# EasyEDA Pro project S1.eprj

# Schematic Schematic1
Board Name: Board1; Create Date: 2025-07-27; Page Name: P1; Project Name: S1; Schematic Name: Schematic1; Update Date: 2025-07-29; Company: EasyEDA.com; Page Size: A4; Version: V1.0
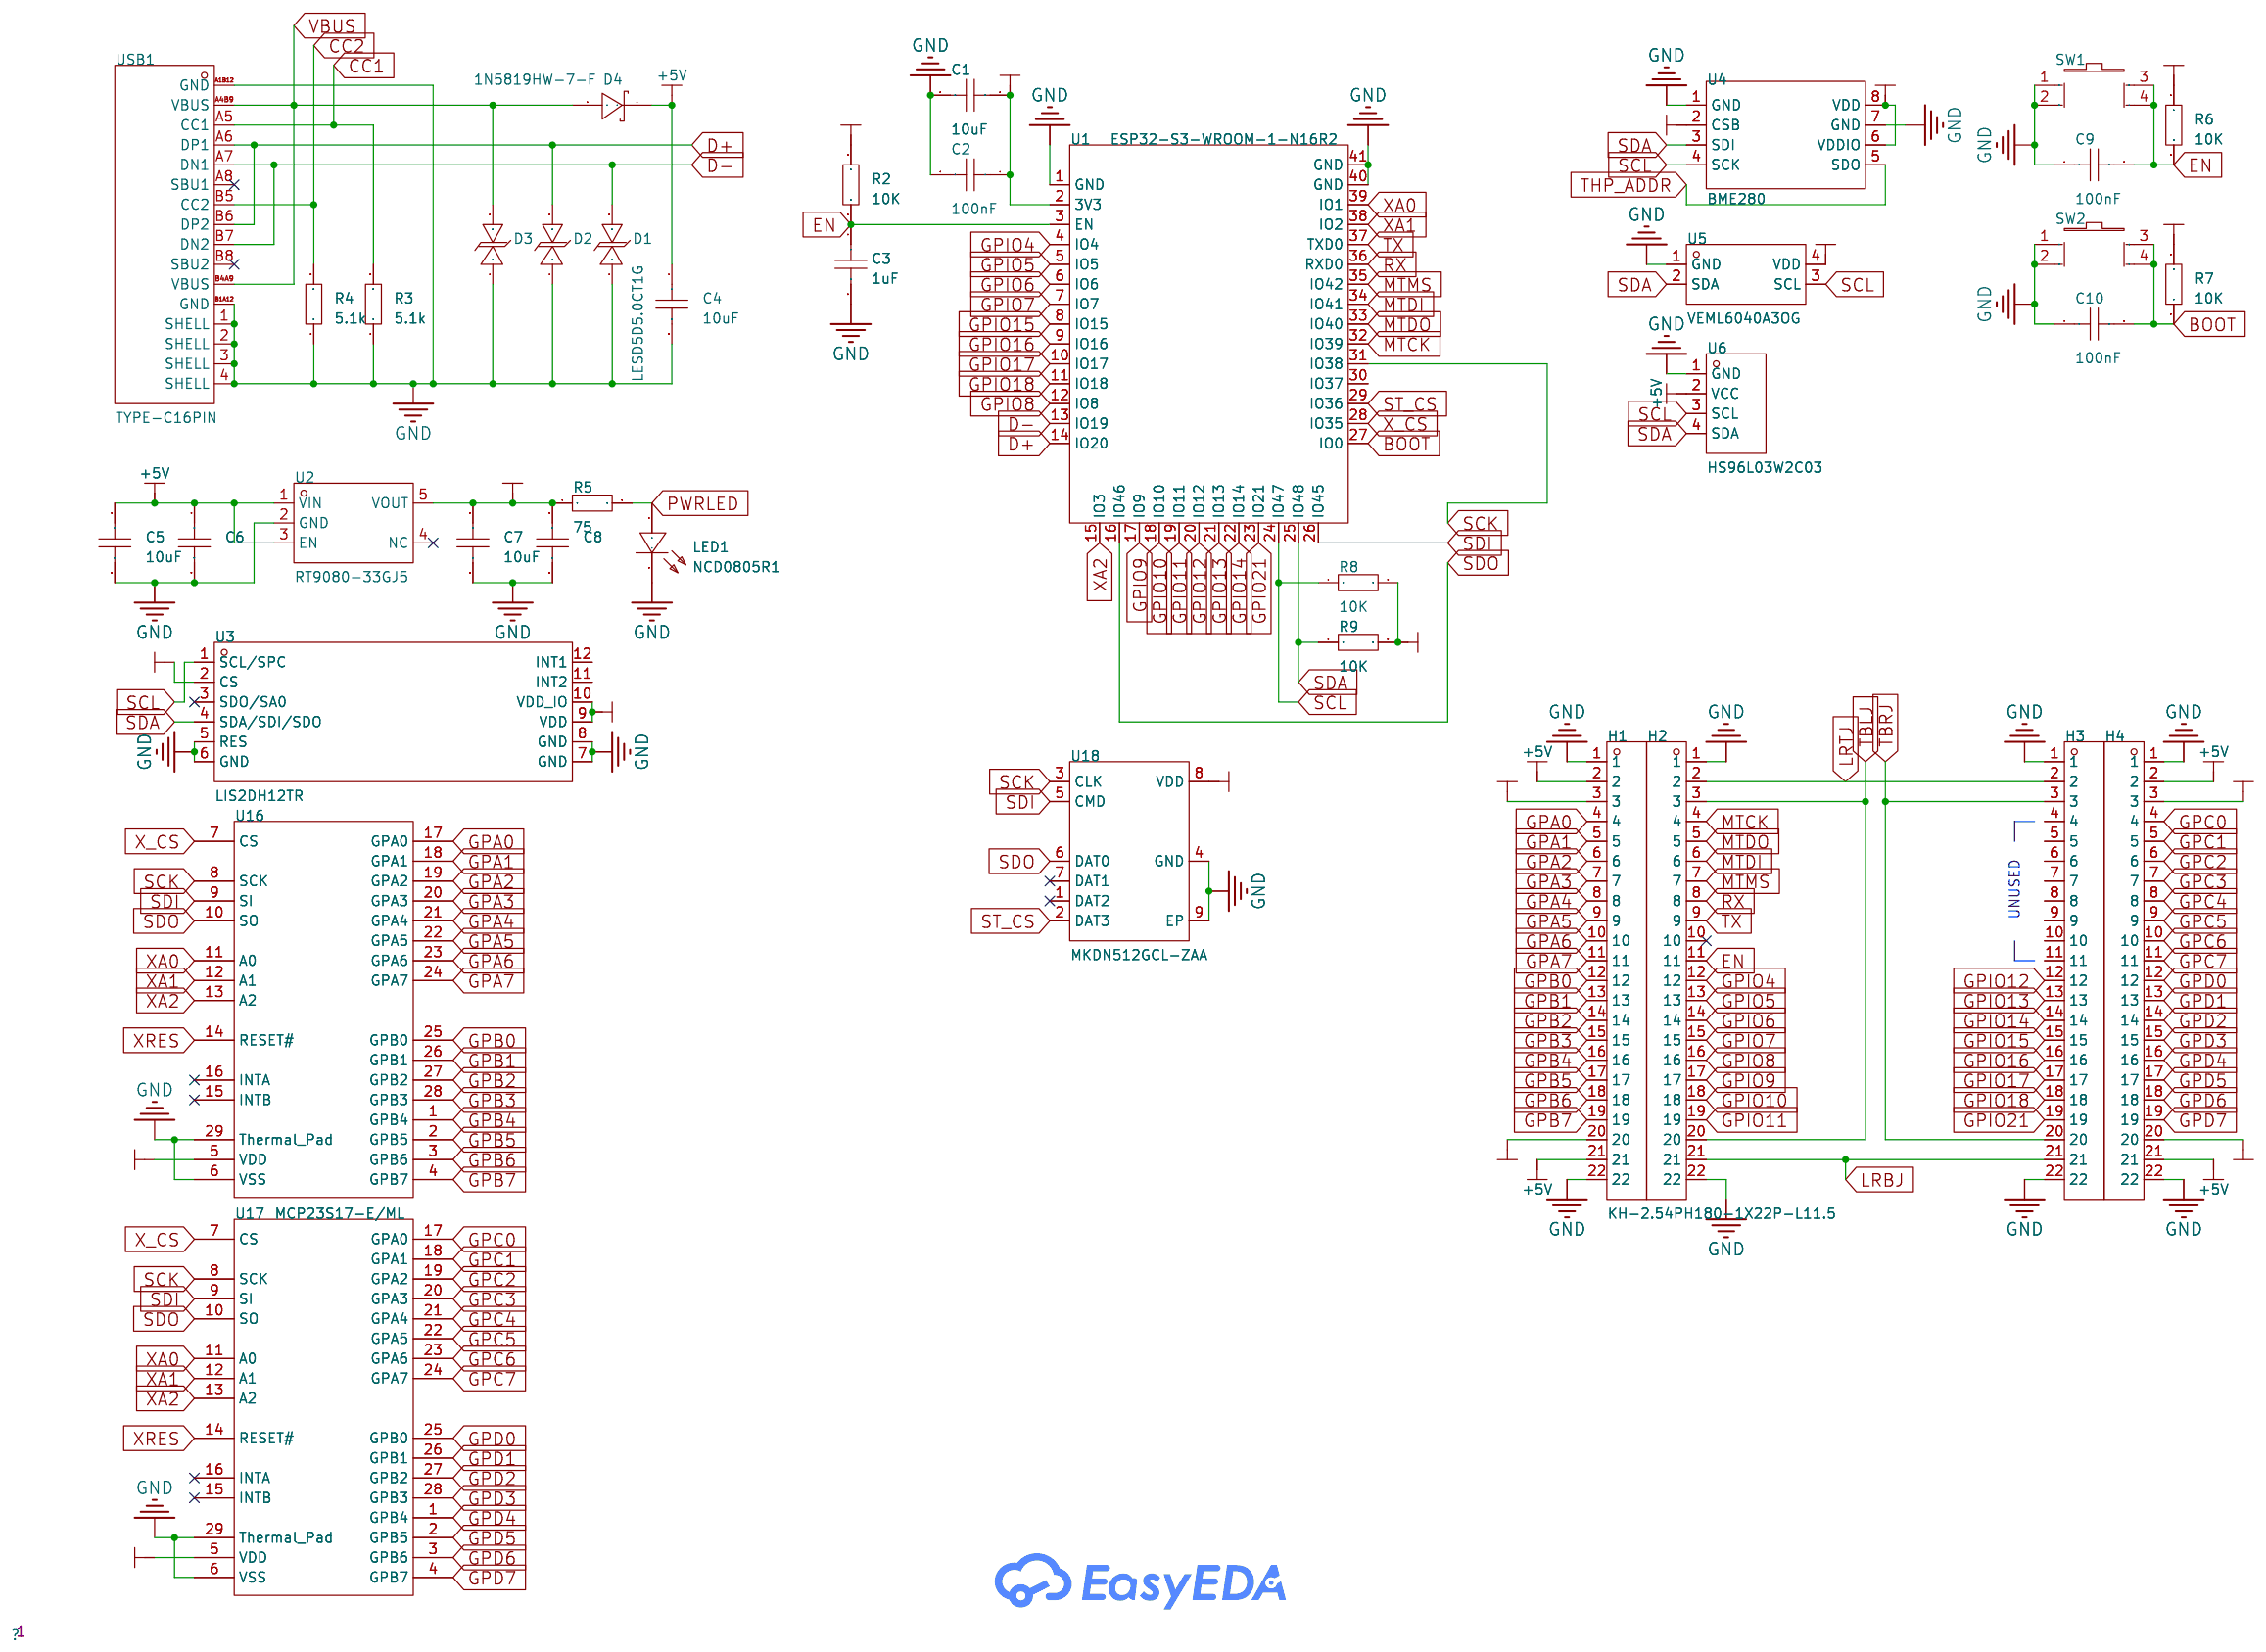
[diagram p0: schematic sheet]

## Parts
C1  10uF  [C0603]
C2  100nF  [C0603]
C3  1uF  [C0603]
C4  10uF  [C0603]
C5  10uF  [C0603]
C6  100nF  [C0603]
C7  10uF  [C0603]
C8  100nF  [C0603]
C9  100nF  [C0603]
C10  100nF  [C0603]
D1  LESD5D5.0CT1G  [SOD-523_L1.2-W0.8-LS1.6-BI]
D2  LESD5D5.0CT1G  [SOD-523_L1.2-W0.8-LS1.6-BI]
D3  LESD5D5.0CT1G  [SOD-523_L1.2-W0.8-LS1.6-BI]
D4  1N5819HW-7-F  [SOD-123_L2.7-W1.6-LS3.7-RD]
H1  KH-2.54PH180-1X22P-L11.5  [HDR-TH_22P-P2.54-V-M]
H2  KH-2.54PH180-1X22P-L11.5  [HDR-TH_22P-P2.54-V-M]
H3  KH-2.54PH180-1X22P-L11.5  [HDR-TH_22P-P2.54-V-M]
H4  KH-2.54PH180-1X22P-L11.5  [HDR-TH_22P-P2.54-V-M]
LED1  NCD0805R1  [LED0805-R-RD]
R2  10K  [R0603]
R3  5.1k  [R0603]
R4  5.1k  [R0603]
R5  75  [R0603]
R6  10K  [R0603]
R7  10K  [R0603]
R8  10K  [R0603]
R9  10K  [R0603]
SW1  PTS810SJG250SMTRLFS  [SW-SMD_4P_PTS810SJM250SMTRLFS]
SW2  PTS810SJG250SMTRLFS  [SW-SMD_4P_PTS810SJM250SMTRLFS]
U1  ESP32-S3-WROOM-1-N16R2  [WIRELM-SMD_ESP32-S3-WROOM-1]
U2  RT9080-33GJ5  [TSOT-23-5_L2.9-W1.6-P0.95-LS2.8-BL]
U3  LIS2DH12TR  [LGA-12_L2.0-W2.0-P0.50-BL]
U4  BME280  [LGA-8_BME280_BL]
U5  VEML6040A3OG  [SENSOR_SMD_VEML6040A3OG]
U6  HS96L03W2C03  [OLED-TH_L27.8-W27.2-P2.54_C9900033791]
U16  MCP23S17-E/ML  [QFN-28_L6.0-W6.0-P0.65-BL-EP]
U17  MCP23S17-E/ML  [QFN-28_L6.0-W6.0-P0.65-BL-EP]
U18  MKDN512GCL-ZAA  [LGA-16_L12.5-W9.0-P1.27-TL-EP]
USB1  TYPE-C16PIN  [USB-C-SMD_TYPE-C16PIN]

## Library data of the parts
C1-C10 = CAP_0603: Supplier Footprint: 0603
D1-D3 = LESD5D5.0CT1G_C5199850: Supplier Part: C5199850; Manufacturer: UMW(友台半导体); Supplier Footprint: SOD-523; JLCPCB Part Class: Extended Part; Datasheet: https://atta.szlcsc.com/upload/public/pdf/source/20231109/3A3F4A5EA6FBA8B622F70BA286F4E0C0.pdf; Supplier: LCSC
D4 = 1N5819HW-7-F: LCSC Part Name: 电压:40V 电流:1A; Supplier Part: C82544; Manufacturer: DIODES(美台); Supplier Footprint: SOD-123; JLCPCB Part Class: Extended Part; Datasheet: https://atta.szlcsc.com/upload/public/pdf/source/20161024/1477288459223.pdf; Supplier: LCSC; Forward Voltage (Vf@If): 450mV@1A; Reverse Voltage (Vr): 40V; Rectified Current: 1A; Reverse Leakage Current (Ir): 1mA@40V
H1-H4 = KH-2.54PH180-1X22P-L11.5: LCSC Part Name: 1x22P 间距:2.54mm; Supplier Part: C20610289; Manufacturer: kinghelm(金航标); Supplier Footprint: 插件,P=2.54mm; JLCPCB Part Class: Extended Part; Datasheet: https://atta.szlcsc.com/upload/public/pdf/source/20240117/4D3622A7E89961A992C721F36FCFC9FD.pdf; Supplier: LCSC; Pin Structure: 1x22P; Pitch: 2.54mm; Number of Rows: Single Row
LED1 = NCD0805R1_C84256: Supplier Part: C84256; Manufacturer: 国星光电; Supplier Footprint: 0805; JLCPCB Part Class: Basic Part; Datasheet: https://atta.szlcsc.com/upload/public/pdf/source/20200820/C84256_F0A75A43B3EAD75808600A0514C76B99.pdf; Supplier: LCSC; Emitted Color: Red; Forward Voltage (VF): 1.6V~2.6V; Power Dissipation: 65mW; Forward Current: 20mA; Dominant Wavelength: 615nm~630nm; Diode Configuration: 独立二极管; Lens Color: 无色透明透镜; Luminous Intensity: 67mcd~195mcd; Viewing Angle: 130°; Operating Temperature: -30℃~+85℃
R2-R9 = Res_0603: Supplier Footprint: 0603
SW1 SW2 = PTS810SJG250SMTRLFS: LCSC Part Name: 轻触开关4.2mm*3.2mm，400gf; Supplier Part: C221895; Manufacturer: C&K; Supplier Footprint: SMD-4P,3.2x4.2mm; JLCPCB Part Class: Extended Part; Datasheet: https://atta.szlcsc.com/upload/public/pdf/source/20180613/C221897_9316320DEFA4333FA0E6C5D565B0D5EA.pdf; Supplier: LCSC; Circuit: SPST; Actuator Style: Round Button; Operating Force: 400gf; Mounting Style: Standing paste; Switch Length: 4.2mm; Switch Width: 3.2mm; Switch Height: 2.5mm; Contact Current: 50mA; Voltage Rating (DC): 16V; Pin Style: J-pin; Operating Temperature: -40℃~+85℃
U1 = ESP32-S3-WROOM-1-N16R2: LCSC Part Name: 通用型Wi-Fi+低功耗蓝牙MCU模组; Supplier Part: C2913205; Manufacturer: ESPRESSIF(乐鑫); Supplier Footprint: SMD,18x25.5mm; JLCPCB Part Class: Extended Part; Datasheet: https://atta.szlcsc.com/upload/public/pdf/source/20220628/A2AC12B3C87735CAEB7EBE2DBE80936C.pdf; Supplier: LCSC
U2 = RT9080-33GJ5: +3V3; Supplier Part: C841192; Manufacturer: RICHTEK(立锜); Supplier Footprint: TSOT-23-5; JLCPCB Part Class: Extended Part; Datasheet: SDA; Supplier: LCSC; Output Type: Fixed; Maximum Input Voltage: 5.5V; Output Voltage: +3V3; Output Current: 600mA; Power Supply Rejection Ratio (PSRR): 75dB@(1kHz); Dropout Voltage: 530mV@(600mA); standby current: 4uA; Feature: ESD Protection；Thermal Protection(TSD)；Overcurrent Protection(OCP)；With ability; Operating Temperature: -40℃~+85℃@(Ta); Output Polarity: Positive electrode; Number of Outputs: 1
U3 = LIS2DH12TR: Supplier Part: C110926; Manufacturer: ST(意法半导体); Supplier Footprint: LGA-12(2x2); JLCPCB Part Class: Extended Part; Datasheet: https://atta.szlcsc.com/upload/public/pdf/source/20171014/C110926_15079752606891037920.pdf; Supplier: LCSC; Axial Direction: X,Y,Z; Supply Voltage: 1.71V~3.6V; Operating Temperature: -40℃~+85℃
U4 = BME280: LCSC Part Name: 湿度：0%RH~100%RH; Supplier Part: C92489; Manufacturer: Bosch(博世); Supplier Footprint: LGA-8(2.5x2.5); JLCPCB Part Class: Extended Part; Datasheet: https://atta.szlcsc.com/upload/public/pdf/source/20230217/9358ECB1DA7C52D8F39392648E599102.pdf; Supplier: LCSC; Voltage - Supply: 1.71V~3.6V
U5 = VEML6040A3OG: Supplier Part: C78465; Manufacturer: VISHAY(威世); Supplier Footprint: OPLGA-4(1.3x2); JLCPCB Part Class: Extended Part; Datasheet: https://atta.szlcsc.com/upload/public/pdf/source/20180511/C78465_1ECCD5CBB0DFD90660DF8047804D95FA.pdf; Supplier: LCSC; Detection color: Red,Green,Blue,White; Interface Type: I2C; Supply Voltage: 2.5V~3.6V; Operating Temperature: -40℃~+85℃
U6 = HS96L03W2C03: LCSC Part Name: 0.96寸OLED显示屏窄白光IIC; Supplier Part: C5248080; Manufacturer: HS(汉昇); JLCPCB Part Class: Extended Part; Datasheet: https://atta.szlcsc.com/upload/public/pdf/source/20230627/763D01F79A90007632F098068C7C8AD9.pdf; Supplier: LCSC; Main Control Chip: SSD1315; Interface Type: I2C; Size: 0.96; Pixel Resolution: 128x64; Operating Temperature: -40℃~+70℃
U16 U17 = MCP23S17-E/ML: Supplier Part: C147896; Manufacturer: MICROCHIP(美国微芯); Supplier Footprint: QFN-28-EP(6x6); JLCPCB Part Class: Extended Part; Datasheet: https://atta.szlcsc.com/upload/public/pdf/source/20171120/C148096_15111748815831131858.pdf; Supplier: LCSC; Interface: SPI; Number of I/O: 16; Interrupt Output: With Interrupt Output; Voltage - Supply: 1.8V~5.5V; Clock Frequency: 10MHz; Operating Temperature: -40℃~+125℃
U18 = MKDN512GCL-ZAA: LCSC Part Name: 512Gb SD NAND 商业级SDNAND; Supplier Part: C17700147; Manufacturer: MK(米客方德); Supplier Footprint: LGA-16(9x12.5); JLCPCB Part Class: Extended Part; Datasheet: https://atta.szlcsc.com/upload/public/pdf/source/20230912/61DE496B9367E626E96A5C5416BBF249.pdf; Supplier: LCSC; Memory Size: 512Gbit; Clock Frequency: 208MHz; Voltage - Supply: 2.7V~3.6V; Operating Temperature: -25℃~+85℃; Interface: SD3.0
USB1 = TYPE-C16PIN: LCSC Part Name: Type-C 母 卧贴; Supplier Part: C393939; Manufacturer: SHOU HAN(首韩); Supplier Footprint: SMD; JLCPCB Part Class: Extended Part; Datasheet: https://atta.szlcsc.com/upload/public/pdf/source/20250618/9FBF2A26CFCE0E69298FA0B726710E9E.pdf; Supplier: LCSC; Connector Type: Type-C; Protocol Standard: USB 3.1; Gender: Female; Mounting Type: Surface Mount, Right Angle; Number of Contacts: 16P; Number of Ports: 1; Current Rating-Power: 3A; Voltage Rating: 30V; Connect-Disconnect Life: 10,000 Cycles; Detection color: Black; Operating Temperature: -40℃~+85℃

## Nets
+3V3: C1.1 C2.1 C7.1 C8.1 H1.3 H1.20 H4.3 H4.20 R2.2 R5.1 R6.1 R7.2 R8.2 R9.2 U1.2(3V3) U2.5(VOUT) U3.2(CS) U3.9(VDD) U3.10(VDD_IO) U4.2(CSB) U4.6(VDDIO) U4.8(VDD) U5.4(VDD) U16.5(VDD) U17.5(VDD) U18.8(VDD)
+5V: C4.1 C5.1 C6.1 D4.1(K) H1.2 H1.21 H4.2 H4.21 U2.1(VIN) U2.3(EN) U6.2(VCC)
GND: C1.2 C2.2 C3.2 C4.2 C5.2 C6.2 C7.2 C8.2 C9.1 C10.1 D1.1 D2.1 D3.1 H1.1 H1.22 H2.1 H2.22 H3.1 H3.22 H4.1 H4.22 LED1.2(-) R3.1 R4.1 SW1.1 SW1.2 SW2.1 SW2.2 U1.1(GND) U1.40(GND) U1.41(GND) U2.2(GND) U3.5(RES) U3.6(GND) U3.7(GND) U3.8(GND) U4.1(GND) U4.7(GND) U5.1(GND) U6.1(GND) U16.6(VSS) U16.29(Thermal Pad) U17.6(VSS) U17.29(Thermal Pad) U18.4(GND) U18.9(EP) USB1.1(SHELL) USB1.2(SHELL) USB1.3(SHELL) USB1.4(SHELL) USB1.A1B12(GND) USB1.B1A12(GND)
VBUS: D3.2 D4.2(A) USB1.A4B9(VBUS) USB1.B4A9(VBUS)
BOOT: C10.2 R7.1 SW2.3 SW2.4 U1.27(IO0)
CC1: R3.2 USB1.A5(CC1)
CC2: R4.2 USB1.B5(CC2)
D+: D2.2 U1.14(IO20) USB1.A6(DP1) USB1.B6(DP2)
D-: D1.2 U1.13(IO19) USB1.A7(DN1) USB1.B7(DN2)
EN: C3.1 C9.2 H2.11 R2.1 R6.2 SW1.3 SW1.4 U1.3(EN)
GPA0: H1.4 U16.17(GPA0)
GPA1: H1.5 U16.18(GPA1)
GPA2: H1.6 U16.19(GPA2)
GPA3: H1.7 U16.20(GPA3)
GPA4: H1.8 U16.21(GPA4)
GPA5: H1.9 U16.22(GPA5)
GPA6: H1.10 U16.23(GPA6)
GPA7: H1.11 U16.24(GPA7)
GPB0: H1.12 U16.25(GPB0)
GPB1: H1.13 U16.26(GPB1)
GPB2: H1.14 U16.27(GPB2)
GPB3: H1.15 U16.28(GPB3)
GPB4: H1.16 U16.1(GPB4)
GPB5: H1.17 U16.2(GPB5)
GPB6: H1.18 U16.3(GPB6)
GPB7: H1.19 U16.4(GPB7)
GPC0: H4.4 U17.17(GPA0)
GPC1: H4.5 U17.18(GPA1)
GPC2: H4.6 U17.19(GPA2)
GPC3: H4.7 U17.20(GPA3)
GPC4: H4.8 U17.21(GPA4)
GPC5: H4.9 U17.22(GPA5)
GPC6: H4.10 U17.23(GPA6)
GPC7: H4.11 U17.24(GPA7)
GPD0: H4.12 U17.25(GPB0)
GPD1: H4.13 U17.26(GPB1)
GPD2: H4.14 U17.27(GPB2)
GPD3: H4.15 U17.28(GPB3)
GPD4: H4.16 U17.1(GPB4)
GPD5: H4.17 U17.2(GPB5)
GPD6: H4.18 U17.3(GPB6)
GPD7: H4.19 U17.4(GPB7)
GPIO4: H2.12 U1.4(IO4)
GPIO5: H2.13 U1.5(IO5)
GPIO6: H2.14 U1.6(IO6)
GPIO7: H2.15 U1.7(IO7)
GPIO8: H2.16 U1.12(IO8)
GPIO9: H2.17 U1.17(IO9)
GPIO10: H2.18 U1.18(IO10)
GPIO11: H2.19 U1.19(IO11)
GPIO12: H3.12 U1.20(IO12)
GPIO13: H3.13 U1.21(IO13)
GPIO14: H3.14 U1.22(IO14)
GPIO15: H3.15 U1.8(IO15)
GPIO16: H3.16 U1.9(IO16)
GPIO17: H3.17 U1.10(IO17)
GPIO18: H3.18 U1.11(IO18)
GPIO21: H3.19 U1.23(IO21)
LRBJ: H2.21 H3.21
LRTJ: H2.2 H3.2
MTCK: H2.4 U1.32(IO39)
MTDI: H2.6 U1.34(IO41)
MTDO: H2.5 U1.33(IO40)
MTMS: H2.7 U1.35(IO42)
PWRLED: LED1.1(+) R5.2
RX: H2.8 U1.36(RXD0)
SCK: U1.31(IO38) U16.8(SCK) U17.8(SCK) U18.3(CLK)
SCL: R8.1 U1.24(IO47) U3.1(SCL/SPC) U4.4(SCK) U5.3(SCL) U6.3(SCL)
SDA: R9.1 U1.25(IO48) U3.4(SDA/SDI/SDO) U4.3(SDI) U5.2(SDA) U6.4(SDA)
SDI: U1.26(IO45) U16.9(SI) U17.9(SI) U18.5(CMD)
SDO: U1.16(IO46) U16.10(SO) U17.10(SO) U18.6(DAT0)
ST_CS: U1.29(IO36) U18.2(DAT3)
TBLJ: H2.3 H2.20
TBRJ: H3.3 H3.20
THP_ADDR: U4.5(SDO)
TX: H2.9 U1.37(TXD0)
X_CS: U1.28(IO35) U16.7(CS) U17.7(CS)
XA0: U1.39(IO1) U16.11(A0) U17.11(A0)
XA1: U1.38(IO2) U16.12(A1) U17.12(A1)
XA2: U1.15(IO3) U16.13(A2) U17.13(A2)
XRES: U16.14(RESET#) U17.14(RESET#)

Not connected (* = marked no-connect by the designer): H2 10*; H3 4 5 6 7 8 9 10 11; U1 30(IO37); U2 4(NC)*; U3 3(SDO/SA0)* 11(INT2) 12(INT1); U16 15(INTB)* 16(INTA)*; U17 15(INTB)* 16(INTA)*; U18 1(DAT2)* 7(DAT1)*; USB1 A8(SBU1)* B8(SBU2)*

## Notes on the sheet
- UNUSED

# Board PCB1
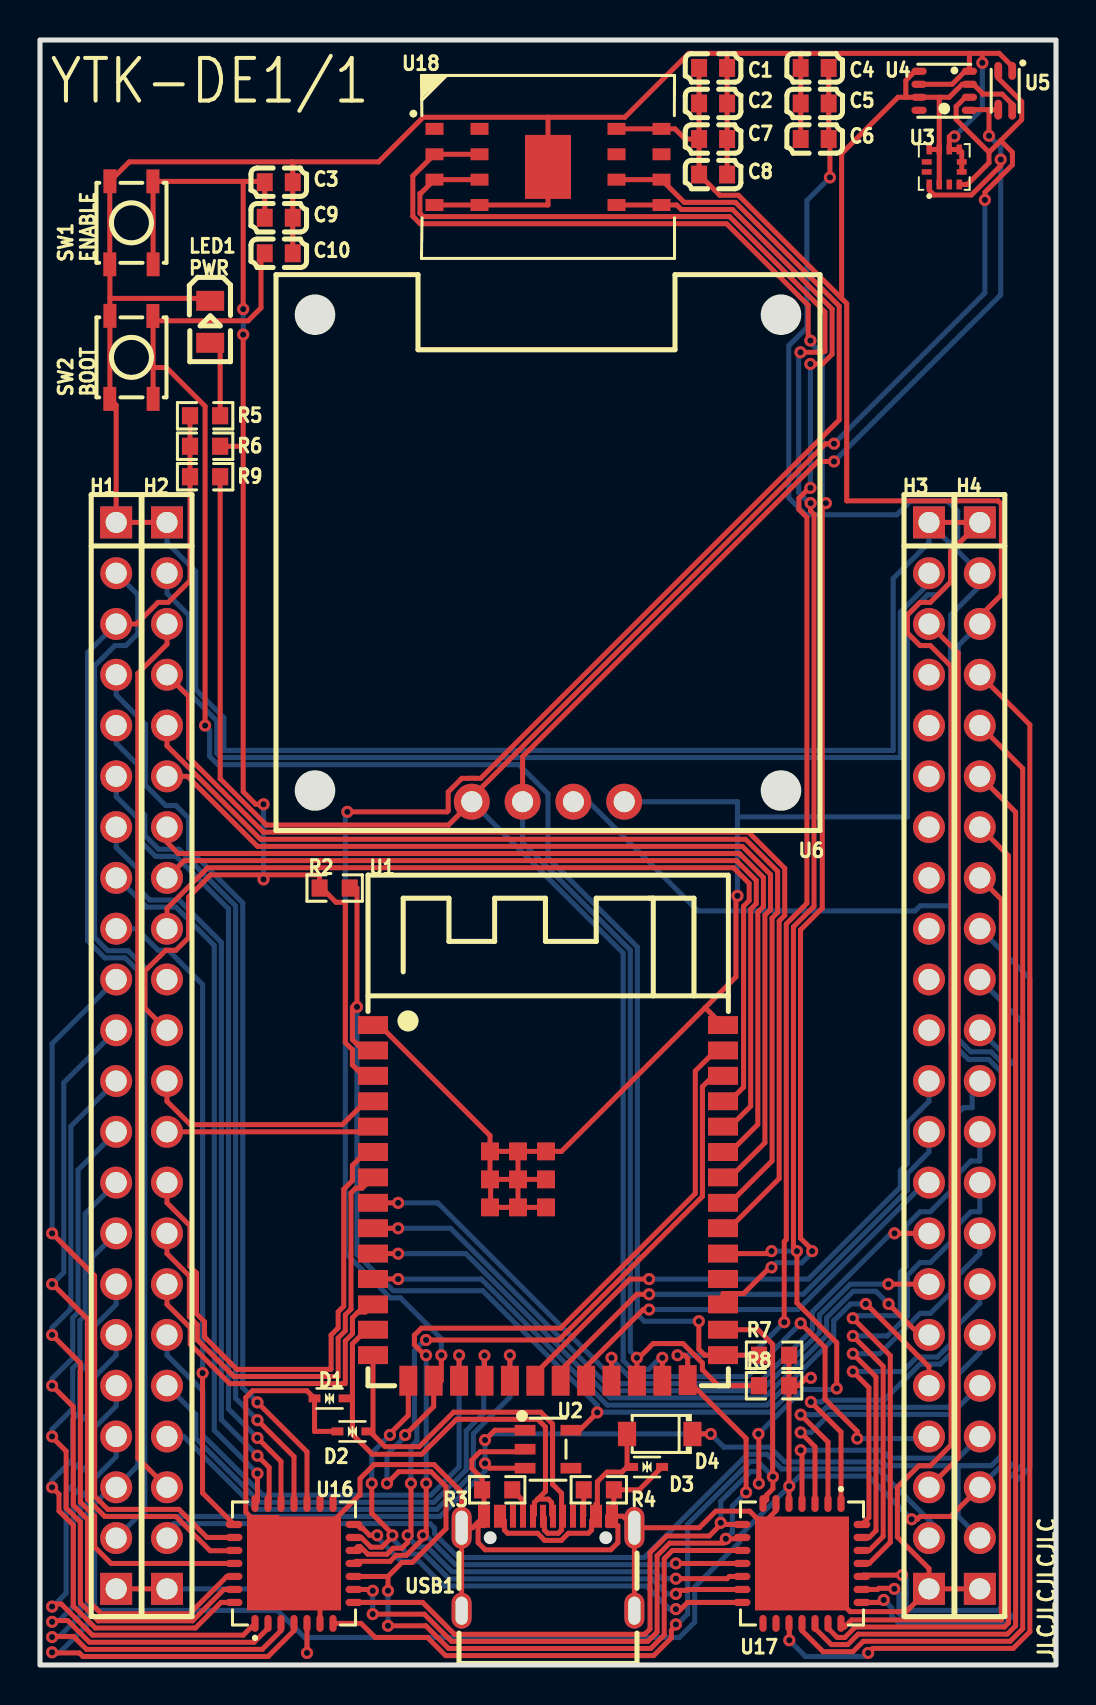
[diagram p1: board, top side]
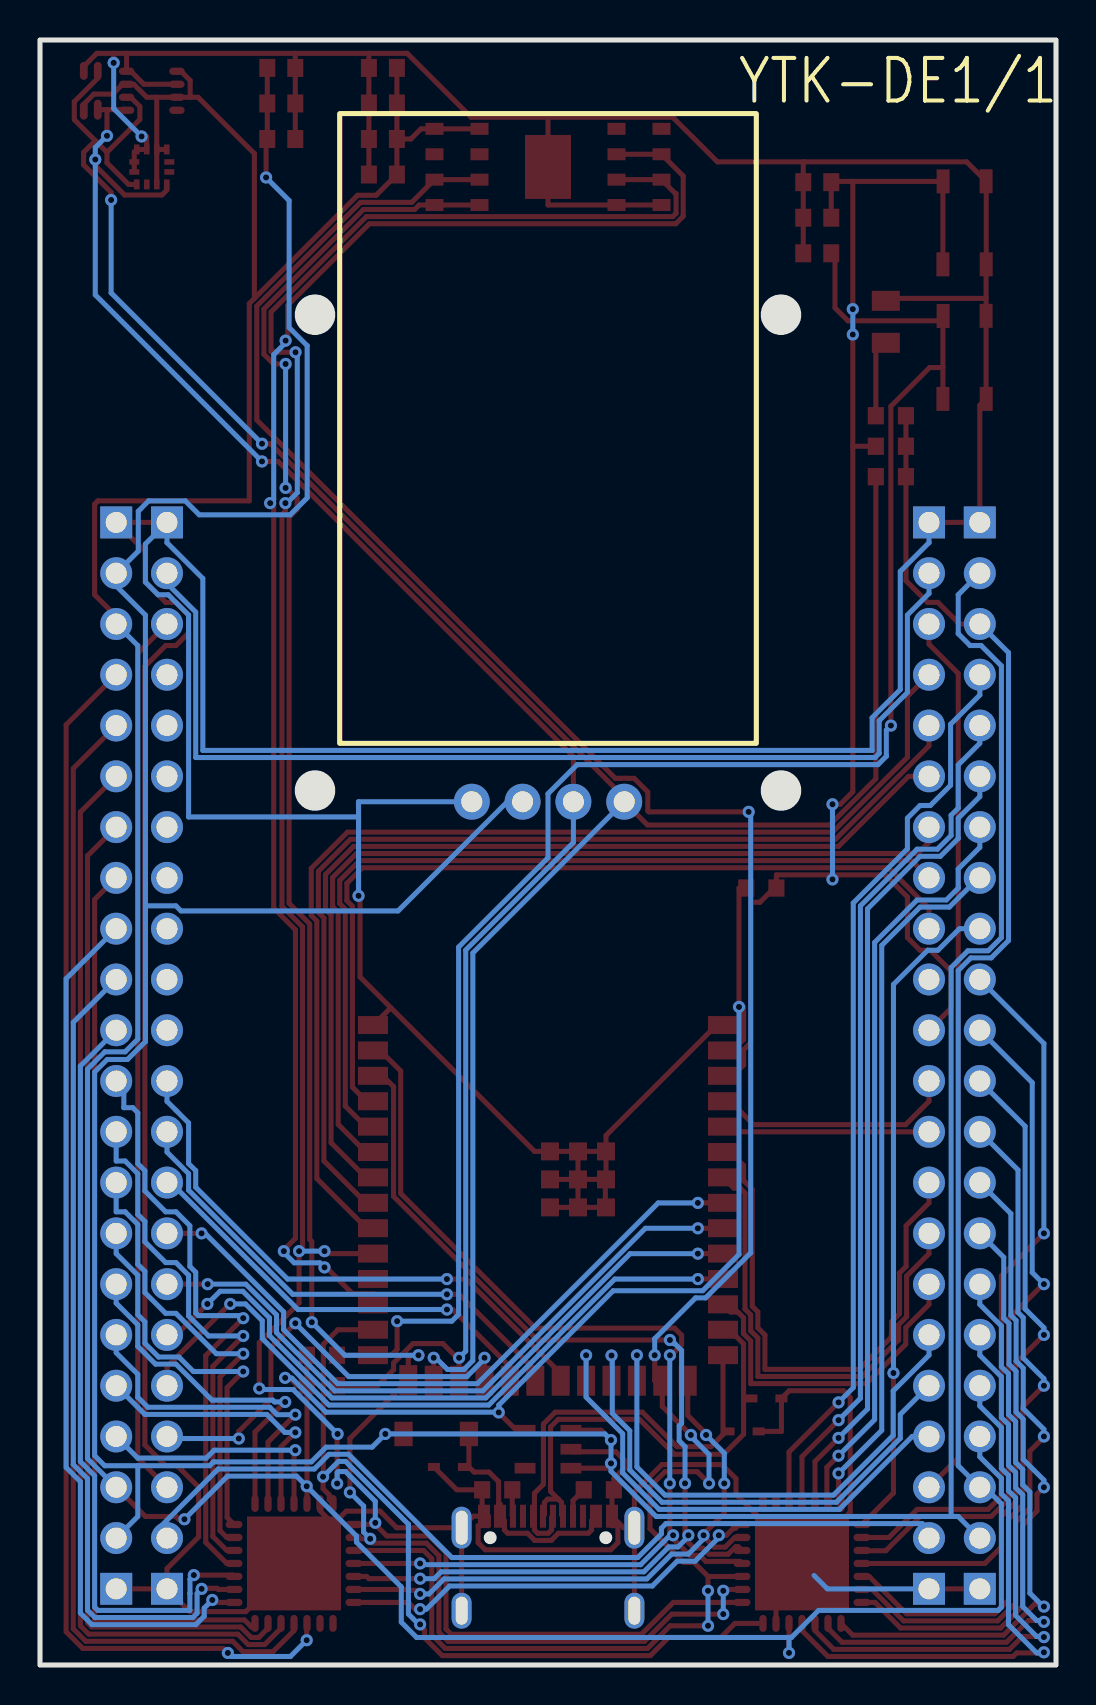
[diagram p2: board, bottom side, seen from below]

Outline 50.8 x 81.28 mm; copper layers: Top Layer, Bottom Layer. Coordinates in mm from the lower left corner of the outline.
Outline path: rectangle 0,81.28 50.8,0
Stack: Top Layer 0.035mm / Dielectric1 1.51mm FR4 er 4.5 / Bottom Layer 0.035mm

## Design rules (mm)
template: JLCPCB Capability(Two Layers Board)
spacing copperThickness1oz (default): track to track 0.102, other pairs 0.152 to 0.3
spacing copperThickness2oz: track to track 0.203, other pairs 0.152 to 0.3
track width copperThickness1oz (default): min 0.127, default 0.254, max 2.54
track width copperThickness2oz: min 0.203, default 0.254, max 2.54
differential pair differentialPair (default): width min 0.127, default 0.254, max 2.54; gap min 0.152, default 0.152
via viaSize (default): diameter min 0.5, default 0.61, max 10; hole min 0.3, default 0.305, max 6.3

## Placement (name value [footprint] x y rotation side)
C1  10uF  [C0603]  33.66 79.88 0 top
C2  100nF  [C0603]  33.66 78.11 0 top
C3  1uF  [C0603]  11.94 74.17 0 top
C4  10uF  [C0603]  38.74 79.88 180 top
C5  10uF  [C0603]  38.74 78.11 180 top
C6  100nF  [C0603]  38.74 76.33 180 top
C7  10uF  [C0603]  33.66 76.33 0 top
C8  100nF  [C0603]  33.66 74.55 0 top
C9  100nF  [C0603]  11.94 72.39 180 top
C10  100nF  [C0603]  11.94 70.61 180 top
D1  LESD5D5.0CT1G  [SOD-523_L1.2-W0.8-LS1.6-BI]  14.48 13.34 0 top
D2  LESD5D5.0CT1G  [SOD-523_L1.2-W0.8-LS1.6-BI]  15.62 11.68 0 top
D3  LESD5D5.0CT1G  [SOD-523_L1.2-W0.8-LS1.6-BI]  30.35 9.91 180 top
D4  1N5819HW-7-F  [SOD-123_L2.7-W1.6-LS3.7-RD]  30.99 11.56 180 top
H1  KH-2.54PH180-1X22P-L11.5  [HDR-TH_22P-P2.54-V-M]  3.81 30.48 270 top
H2  KH-2.54PH180-1X22P-L11.5  [HDR-TH_22P-P2.54-V-M]  6.35 30.48 270 top
H3  KH-2.54PH180-1X22P-L11.5  [HDR-TH_22P-P2.54-V-M]  44.45 30.48 270 top
H4  KH-2.54PH180-1X22P-L11.5  [HDR-TH_22P-P2.54-V-M]  46.99 30.48 270 top
LED1
PWR  -  [LED0805-R-RD]  8.51 67.18 270 top
R2  10K  [R0603]  14.73 38.86 0 top
R3  5.1k  [R0603]  22.86 8.76 0 top
R4  5.1k  [R0603]  27.94 8.76 180 top
R5  75  [R0603]  8.25 62.48 0 top
R6  10K  [R0603]  8.25 60.96 0 top
R7  10K  [R0603]  36.7 15.49 0 top
R8  10K  [R0603]  36.7 13.97 0 top
R9  10K  [R0603]  8.25 59.44 180 top
SW1
ENABLE  -  [SW-SMD_4P_PTS810SJM250SMTRLFS]  4.57 72.14 90 top
SW2
BOOT  -  [SW-SMD_4P_PTS810SJM250SMTRLFS]  4.57 65.41 90 top
U1  ESP32-S3-WROOM-1-N16R2  [WIRELM-SMD_ESP32-S3-WROOM-1]  25.4 23.11 0 top
U2  RT9080-33GJ5  [TSOT-23-5_L2.9-W1.6-P0.95-LS2.8-BL]  25.4 10.8 270 top
U3  LIS2DH12TR  [LGA-12_L2.0-W2.0-P0.50-BL]  45.21 74.93 0 top
U4  BME280  [LGA-8_BME280_BL]  45.21 78.74 0 top
U5  VEML6040A3OG  [SENSOR_SMD_VEML6040A3OG]  48.26 78.74 0 top
U6  HS96L03W2C03  [OLED-TH_L27.8-W27.2-P2.54_C9900033791]  25.4 43.18 180 top
U16  MCP23S17-E/ML  [QFN-28_L6.0-W6.0-P0.65-BL-EP]  12.7 5.08 0 top
U17  MCP23S17-E/ML  [QFN-28_L6.0-W6.0-P0.65-BL-EP]  38.1 5.08 180 top
U18  MKDN512GCL-ZAA  [LGA-16_L12.5-W9.0-P1.27-TL-EP]  25.4 74.93 0 top
USB1  TYPE-C16PIN  [USB-C-SMD_TYPE-C16PIN]  25.4 5.08 0 top

## Footprints (pads in the part's own frame, mm; a bottom-side part is the same pattern mirrored in y, then rotated)
C0603
  rect 0.8x0.9 smd: 1(-0.7,0) 2(0.7,0)
HDR-TH_22P-P2.54-V-M
  rect 1.6x1.6 hole 1.05: 1(-26.67,0) 22(26.67,0)
  round 1.6 hole 1.05: 2(-24.13,0) 3(-21.59,0) 4(-19.05,0) 5(-16.51,0) 6(-13.97,0) 7(-11.43,0) 8(-8.89,0) 9(-6.35,0) 10(-3.81,0) 11(-1.27,0) 12(1.27,0) 13(3.81,0) 14(6.35,0) 15(8.89,0) 16(11.43,0) 17(13.97,0) 18(16.51,0) 19(19.05,0) 20(21.59,0) 21(24.13,0)
LED0805-R-RD
  rect 1x1.399 smd: 1(1.05,0) 2(-1.05,0)
LGA-8_BME280_BL
  oval 0.767x0.364 smd: 1(1.258,0.975) 2(1.258,0.325) 3(1.258,-0.325) 4(1.258,-0.975) 5(-1.258,-0.975) 6(-1.258,-0.325) 7(-1.258,0.325) 8(-1.258,0.975)
LGA-12_L2.0-W2.0-P0.50-BL
  rect 0.28x0.5 smd: 1(-0.75,-0.875) 2(-0.25,-0.875) 3(0.25,-0.875) 4(0.75,-0.875) 7(0.75,0.875) 8(0.25,0.875) 9(-0.25,0.875) 10(-0.75,0.875)
  rect 0.5x0.28 smd: 5(0.875,-0.25) 6(0.875,0.25) 11(-0.875,0.25) 12(-0.875,-0.25)
LGA-16_L12.5-W9.0-P1.27-TL-EP
  rect 0.9x0.6 smd: 1(-5.675,1.905) 1(-3.425,1.905) 2(-5.675,0.635) 2(-3.425,0.635) 3(-5.675,-0.635) 3(-3.425,-0.635) 4(-5.675,-1.905) 4(-3.425,-1.905) 5(3.425,-1.905) 5(5.675,-1.905) 6(3.425,-0.635) 6(5.675,-0.635) 7(3.425,0.635) 7(5.675,0.635) 8(3.425,1.905) 8(5.675,1.905)
  rect 2.3x3.2 smd: 9(0,0)
OLED-TH_L27.8-W27.2-P2.54_C9900033791
  round 1.8 hole 1.05: 1(-3.81,0) 2(-1.27,0) 3(1.27,0) 4(3.81,0)
QFN-28_L6.0-W6.0-P0.65-BL-EP
  oval 0.364x0.847 smd: 1(-1.95,-2.998) 2(-1.3,-2.998) 3(-0.65,-2.998) 4(0,-2.998) 5(0.65,-2.998) 6(1.3,-2.998) 7(1.95,-2.998) 15(1.95,2.998) 16(1.3,2.998) 17(0.65,2.998) 18(0,2.998) 19(-0.65,2.998) 20(-1.3,2.998) 21(-1.95,2.998)
  oval 0.847x0.364 smd: 8(2.998,-1.95) 9(2.998,-1.3) 10(2.998,-0.65) 11(2.998,0) 12(2.998,0.65) 13(2.998,1.3) 14(2.998,1.95) 22(-2.998,1.95) 23(-2.998,1.3) 24(-2.998,0.65) 25(-2.998,0) 26(-2.998,-0.65) 27(-2.998,-1.3) 28(-2.998,-1.95)
  rect 4.7x4.7 smd: 29(0,0)
R0603
  rect 0.806x0.864 smd: 1(-0.753,0) 2(0.753,0)
SENSOR_SMD_VEML6040A3OG
  oval 0.392x0.9 smd: 1(0.35,0.996) 2(-0.35,0.996) 4(0.35,-0.996)
  oval 0.392x1 smd: 3(-0.35,-0.946)
SOD-123_L2.7-W1.6-LS3.7-RD
  rect 0.91x1.22 smd: 1(-1.635,0) 2(1.635,0)
SOD-523_L1.2-W0.8-LS1.6-BI
  rect 0.6x0.4 smd: 1(-0.75,0) 2(0.75,0)
SW-SMD_4P_PTS810SJM250SMTRLFS
  rect 1.2x0.65 smd: 1(-2.078,1.083) 2(2.078,1.075) 3(-2.077,-1.083) 4(2.071,-1.075)
TSOT-23-5_L2.9-W1.6-P0.95-LS2.8-BL
  rect 0.532x1.045 smd: 1(-0.95,-1.147) 2(0,-1.147) 3(0.95,-1.147) 4(0.95,1.147) 5(-0.95,1.147)
USB-C-SMD_TYPE-C16PIN
  oval 1x2.1 hole 0.6x1.7: 1(-4.32,1.788) 2(4.32,1.788)
  oval 1x1.8 hole 0.6x1.4: 3(-4.32,-2.362) 4(4.32,-2.362)
  rect 0.6x1.15 smd: A1B12(-3.2,2.362) A4B9(-2.4,2.362) B1A12(3.2,2.362) B4A9(2.4,2.362)
  rect 0.3x1.15 smd: A5(-1.25,2.362) A6(-0.25,2.362) A7(0.25,2.362) A8(1.25,2.362) B5(1.75,2.362) B6(0.75,2.362) B7(-0.75,2.362) B8(-1.75,2.362)
WIRELM-SMD_ESP32-S3-WROOM-1
  rect 1.5x0.9 smd: 1(-8.75,8.895) 2(-8.75,7.625) 3(-8.75,6.355) 4(-8.75,5.085) 5(-8.75,3.815) 6(-8.75,2.545) 7(-8.75,1.275) 8(-8.75,0.005) 9(-8.75,-1.265) 10(-8.75,-2.535) 11(-8.75,-3.805) 12(-8.75,-5.075) 13(-8.75,-6.345) 14(-8.75,-7.615) 27(8.75,-7.615) 28(8.75,-6.345) 29(8.75,-5.075) 30(8.75,-3.805) 31(8.75,-2.535) 32(8.75,-1.265) 33(8.75,0.005) 34(8.75,1.275) 35(8.75,2.545) 36(8.75,3.815) 37(8.75,5.085) 38(8.75,6.355) 39(8.75,7.625) 40(8.75,8.895)
  rect 0.9x1.5 smd: 15(-6.985,-8.895) 16(-5.715,-8.895) 17(-4.445,-8.895) 18(-3.175,-8.895) 19(-1.905,-8.895) 20(-0.635,-8.895) 21(0.635,-8.895) 22(1.905,-8.895) 23(3.175,-8.895) 24(4.445,-8.895) 25(5.715,-8.895) 26(6.985,-8.865)
  rect 0.9x0.9 smd: 41(-2.9,2.575) 41(-2.9,1.175) 41(-2.9,-0.225) 41(-1.5,2.575) 41(-1.5,1.175) 41(-1.5,-0.225) 41(-0.1,2.575) 41(-0.1,1.175) 41(-0.1,-0.225)

## Nets
As in the schematic, except:
GND: C1.2 C2.2 C3.2 C4.2 C5.2 C6.2 C7.2 C8.2 C9.1 C10.1 D1.1 D2.1 D3.1 H1.1 H1.22 H2.1 H2.22 H3.1 H3.22 H4.1 H4.22 LED1
PWR.2 R3.1 R4.1 SW1
ENABLE.1 SW1
ENABLE.2 SW2
BOOT.1 SW2
BOOT.2 U1.1 U1.40 U1.41 U2.2 U3.5 U3.6 U3.7 U3.8 U4.1 U4.7 U5.1 U6.1 U16.6 U16.29 U17.6 U17.29 U18.4 U18.9 USB1.1 USB1.2 USB1.3 USB1.4 USB1.A1B12 USB1.B1A12
BOOT: C10.2 R7.1 SW2
BOOT.3 SW2
BOOT.4 U1.27
EN: C3.1 C9.2 H2.11 R2.1 R6.2 SW1
ENABLE.3 SW1
ENABLE.4 U1.3
PWRLED: LED1
PWR.1 R5.2

Pads without a net: H2 10; H3 4 5 6 7 8 9 10 11; U1 30; U2 4; U3 3 11 12; U16 15 16; U17 15 16; U18 1 7; USB1 A8 B8

## Via types
v1: diameter 0.61, hole 0.305, Top Layer to Bottom Layer, 114 vias

## Routing (per net, layer and track width the routed paths; a pad name or vN(x,y) marks a point on that pad's centre or on a via; arc(x,y) is an arc through that point)
+3V3: length 291.7
  Top Layer w0.254: 44.96,78.42 45.46,78.42 46.11,79.07 U4.2 46.67,79.07 47.13,78.61 47.13,78.57 48.11,78.57 48.61,78.07 U5.4 ; 44.96,78.42 U3.9 ; 44.96,78.42 U4.6 43.29,78.42 ; 43.29,78.42 43.29,79.26 43.75,79.72 43.95,79.72 ; 43.29,78.42 42.9,78.42 40.08,75.6 40.08,68.35 ; H4.3 46.99,52.45 48.07,53.53 48.07,58.07 47.91,58.23 40.34,58.23 40.34,68.1 40.08,68.35 ; H4.20 45.53,7.43 44,7.43 43.86,7.29 v1(43.58,7.29) ; R8.2 37.96,13.97 37.96,14 38.43,14.47 v1(38.54,14.36) ; 40.08,68.35 34.92,73.51 33.99,73.51 C8.1 C7.1 ; U3.9 U3.2 ; U3.9 U3.10 ; v1(13.35,0.61) U16.5 ; C7.1 C2.1 C1.1 ; C7.1 32.26,76.33 31.75,76.84 U18.8 U18.8 ; 26.55,11.62 26.86,11.62 27.86,12.62 v1(27.86,12.63) ; H1.3 4.82,52.07 5.9,53.15 6.41,53.15 7.5,54.24 R9.2 R6.1 7.5,62.36 ; v1(15.85,32.92) 15.85,38.86 R2.2 ; U17.5 37.45,15.37 ; 15.62,32.92 15.62,31.28 16.16,30.74 U1.2
  Bottom Layer w0.254: 13.35,0.43 13.35,1.38 ; 13.35,1.38 13.23,1.38 11.87,2.73 2.89,2.73 2.73,2.89 2.73,8.07 3.56,8.89 H1.20 4.89,9.97 4.89,34.74 4.26,35.37 3.24,35.37 2.38,36.24 2.38,50.64 3.81,52.07 ; 13.35,1.38 31.97,1.38 32.74,2.15 32.74,3.91 34.98,6.15 34.98,6.45 v1(37.47,8.94) 37.97,9.45 41.42,9.45 v1(43.58,7.29) ; H4.20 48.43,10.33 48.43,29.8 47.56,30.67 46.54,30.67 45.91,31.3 45.91,50.99 H4.3 ; v1(15.85,32.92) 15.85,20.54 17.66,18.72 22.14,18.72 27.86,13.01 27.85,13 27.85,12.65 36.5,12.65 38.21,14.35 38.53,14.35 v1(38.54,14.36)
+5V: length 210.9
  Top Layer w0.254: v1(39.5,74.4) 39.5,76.33 C6.1 C5.1 C4.1 ; U2.1 22.74,11.75 v1(22.25,11.25) ; 24.25,9.84 22.49,9.84 v1(22.25,10.08) ; v1(33.53,11.56) 32.62,11.56
  Bottom Layer w0.254: v1(39.5,74.4) 38.34,73.25 38.34,66.9 37.44,65.99 37.44,58.38 38.29,57.53 42.84,57.53 43.53,58.23 45.37,58.23 45.89,57.71 45.89,55.71 H4.2 46.99,53.98 45.53,52.51 45.53,37.97 ; H1.2 4.89,53.53 4.89,51.59 4.29,50.99 3.75,50.99 2.73,49.98 2.73,36.38 3.39,35.73 4.4,35.73 5.25,34.88 5.25,7.43 ; 45.53,37.97 45.53,31.18 46.42,30.29 47.44,30.29 48.07,29.66 48.07,10.47 47.57,9.97 45.91,9.97 ; 45.53,37.97 44.01,37.97 43.75,37.72 32.89,37.72 27.43,43.18 U6.2 ; 5.25,7.43 19.99,7.43 22.25,9.69 v1(22.25,10.08) v1(22.25,11.25) 22.56,11.56 v1(33.53,11.56) 34.19,10.9 36.49,10.9 37.23,10.16 42.13,10.16 42.32,9.97 45.91,9.97 ; 5.25,7.43 4.89,7.43 H1.21 ; 45.91,9.97 45.91,7.43 H4.21
GND: length 396.3
  Top Layer w0.254: 25.4,77.41 U18.9 25.4,73.03 U18.4 U18.4 ; 25.4,77.41 19.16,77.41 16.93,75.18 12.64,75.18 ; 25.4,77.41 29.24,77.41 32.44,80.61 34.36,80.61 ; H2.1 H1.1 3.81,63.01 3.5,63.33 ; 3.5,63.33 SW2
BOOT.2 3.5,68.36 ; 3.5,63.33 SW2
BOOT.1 ; USB1.1 21.62,6.87 USB1.A1B12 ; USB1.1 USB1.3 ; USB1.1 21.08,8.65 19.7,10.03 16.71,10.03 16,9.32 16,8.5 15.97,8.5 13.3,5.84 13.3,5.68 ; 46.47,80.61 38.03,80.61 ; 46.47,80.61 46.47,79.72 46.26,79.72 45.61,79.07 U4.7 ; 46.47,80.61 47.12,80.61 ; 38.03,80.61 34.36,80.61 ; 38.03,80.61 C4.2 C5.2 C6.2 ; USB1.B1A12 28.69,7.54 R4.1 29.96,8.76 D3.1 ; USB1.B1A12 29.15,7.44 USB1.2 ; USB1.B1A12 28.38,7.44 28.38,6.97 28.89,6.97 28.89,6.12 28.54,5.76 22.26,5.76 21.91,6.12 21.91,6.97 22.22,6.97 22.22,7.44 USB1.A1B12 ; 22.5,25.69 23.9,25.69 ; 22.5,25.69 U1.41 ; 22.5,25.69 22.5,26.48 16.97,32.01 U1.1 ; 23.9,25.69 U1.41 ; 23.9,25.69 26.07,25.69 33.26,32.88 ; H3.1 H4.1 45.53,55.69 45.53,54.16 44.52,53.15 44,53.15 43.37,52.52 43.37,51.62 44,50.99 44.52,50.99 45.56,49.95 45.56,11.01 44.52,9.97 43.94,9.97 42.87,8.9 42.87,6.41 44.45,4.82 H3.22 ; 38.7,4.48 40.51,2.67 43.31,2.67 H3.22 ; 34.36,80.61 34.36,74.55 ; U1.41 23.9,22.89 ; U1.41 U1.41 ; U1.41 U1.41 ; D2.1 13.73,11.68 D1.1 13.34,13.72 10.63,13.72 10.29,13.38 10.29,7.65 10.56,7.38 11.86,7.38 12.1,7.14 12.1,5.68 ; 23.9,22.89 25.3,22.89 ; 23.9,22.89 22.5,22.89 22.53,22.92 22.53,24.26 U1.41 ; 24.25,10.67 22.01,10.67 21.59,10.25 21.59,9.84 22.11,9.33 R3.1 22.2,8.67 USB1.A1B12 ; USB1.2 USB1.4 ; USB1.2 32.97,6.87 33.79,7.7 35.48,7.7 36.13,7.05 ; 36.13,7.05 37.5,5.68 ; 36.13,7.05 36.8,7.72 U17.6 ; H1.22 H2.22 ; v1(47.12,80.14) 47.12,80.61 ; 47.12,80.61 47.96,80.61 48.61,79.96 U5.1 ; 12.64,75.18 C3.2 C9.1 C10.1 ; 12.64,75.18 4.47,75.18 SW1
ENABLE.2 3.49,74.21 SW1
ENABLE.1 ; 3.5,68.36 3.5,70.06 ; 3.5,68.36 8.39,68.36 LED1
PWR.2 ; H3.22 H4.22 ; 33.26,32.88 34.8,34.42 34.8,38.4 v1(34.87,38.47) ; 33.26,32.88 34.13,32.01 U1.40 ; 45.47,75.81 45.47,76.45 v1(45.72,76.45) ; 45.47,75.81 U3.8 ; 45.47,75.81 U3.7 46.09,75.68 U3.6 U3.5 ; 13.3,4.48 14,3.78 U16.6
  Bottom Layer w0.254: v1(45.72,76.45) 47.12,77.85 v1(47.12,80.14) ; H2.1 6.35,56.14 7.78,54.7 7.78,48.79 9.19,47.38 9.19,45.75 42.66,45.75 42.66,54.35 44.45,56.14 H3.1 45.53,56.07 45.53,54.16 44.9,53.53 44.39,53.53 43.37,52.52 43.37,42.42 34.87,42.42 ; H2.22 11.43,3.81 12.1,4.48 ; 34.87,42.42 34.87,43.18 U6.1 ; 34.87,42.42 v1(34.87,38.47)
VBUS: length 11.8
  Top Layer w0.254: D4.2 29.35,9.91 ; 29.35,9.91 29.1,9.65 28.35,9.65 27.87,9.17 27.87,8.05 27.8,8.05 USB1.B4A9 27.58,7.22 27.58,6.75 27.42,6.59 26.42,6.59 26.06,6.23 25.24,6.23 24.88,6.59 23.38,6.59 23.22,6.75 23.22,7.22 USB1.A4B9 ; 29.35,9.91 D3.2
BOOT: length 86.9
  Top Layer w0.254: v1(8.25,46.99) 8.25,62.96 6.32,64.9 5.66,64.9 ; 5.66,64.9 5.66,67.48 ; 5.66,64.9 SW2
BOOT.3 ; 5.66,67.48 SW2
BOOT.4 ; 5.66,67.48 5.9,67.23 10.4,67.23 11.05,67.88 11.05,70.42 C10.2 ; 35.82,15.49 35.82,15.5 U1.27 33.23,15.5 32.94,15.79 v1(32.94,17.2)
  Bottom Layer w0.254: v1(8.25,46.99) 8.48,46.76 8.48,45.45 8.9,45.04 23.94,45.04 25.4,43.58 25.4,40.38 29.87,35.91 29.87,17.54 30.21,17.2 v1(32.94,17.2)
CC1: length 1.5
  Top Layer w0.254: R3.2 24.15,8.23 USB1.A5
CC2: length 1.3
  Top Layer w0.254: R4.2 27.19,7.48 USB1.B5
D+: length 21.4
  Top Layer w0.254: U1.14 16.65,11.53 17.25,10.92 18.96,10.92 20.68,12.65 25.04,12.65 25.63,12.06 25.63,9.04 26.08,8.59 26.08,7.51 USB1.B6 26.08,7.37 26.08,6.75 25.92,6.59 25.38,6.59 25.22,6.75 25.22,7.37 USB1.A6
D-: length 23
  Top Layer w0.254: USB1.B7 24.72,7.51 24.72,8.13 24.88,8.3 ; USB1.A7 25.58,7.51 25.58,8.13 25.42,8.3 24.88,8.3 ; 24.88,8.3 25.27,8.69 25.27,11.91 24.89,12.29 20.83,12.29 19.08,10.54 16.62,10.54 15.62,11.54 15.62,16.06 16.33,16.77 U1.13
EN: length 75.6
  Top Layer w0.254: 5.66,74.21 10.16,74.21 ; 5.66,74.21 SW1
ENABLE.3 ; 5.66,74.21 SW1
ENABLE.4 ; 10.16,74.21 11.24,74.21 C3.1 C9.2 ; 10.16,74.21 v1(10.16,67.82) ; v1(10.16,66.55) 10.16,60.96 ; 10.16,60.96 R6.2 ; 10.16,60.96 10.16,43.68 10.78,43.05 v1(11.18,43.05) ; 11.18,39.52 v1(11.18,39.29) ; 11.18,39.52 8.53,39.52 7.43,38.42 7.43,36.38 6.8,35.75 6.28,35.75 5.25,34.71 5.25,32.86 H2.11 ; 11.18,39.52 13.98,39.52 R2.1 14.09,38.86 14.8,38.15 15.24,38.15 15.27,38.13 15.27,31.13 15.62,30.78 15.62,30.01 16.16,29.47 16.65,29.47
  Bottom Layer w0.254: v1(10.16,66.55) v1(10.16,67.82) ; v1(11.18,39.29) v1(11.18,43.05)
GPA0: length 45.7
  Top Layer w0.254: U16.17 13.35,10.66 v1(10.87,13.14)
  Bottom Layer w0.254: v1(10.87,13.14) 10.14,13.87 10.14,38.12 7.43,40.82 7.43,42.36 6.8,42.99 6.28,42.99 5.27,44 5.27,47.06 3.81,48.52 H1.4
GPA1: length 43.2
  Top Layer w0.254: U16.18 12.7,10.42 v1(10.87,12.25)
  Bottom Layer w0.254: v1(10.87,12.25) 9.78,13.34 9.78,37.97 6.94,40.81 5.93,40.81 5.25,41.49 5.25,42.5 4.89,42.86 4.89,45.02 3.81,46.1 H1.5
GPA2: length 40.4
  Top Layer w0.254: U16.19 12.05,10.18 v1(10.87,11.36)
  Bottom Layer w0.254: H1.6 3.81,43.44 4.89,42.36 4.89,41.34 5.78,40.45 6.8,40.45 9.42,37.82 9.42,12.81 v1(10.87,11.36)
GPA3: length 37.9
  Top Layer w0.254: U16.20 11.4,8.36 11.46,8.36 11.46,9.88 v1(10.87,10.47)
  Bottom Layer w0.254: H1.7 3.81,40.9 4.89,39.82 4.89,38.86 5.48,38.27 6.94,38.27 9.07,36.14 9.07,12.27 v1(10.87,10.47)
GPA4: length 35.2
  Top Layer w0.254: v1(10.87,9.58) 10.87,8.2 U16.21
  Bottom Layer w0.254: v1(10.87,9.58) 8.71,11.74 8.71,35.99 6.8,37.91 5.34,37.91 3.87,39.37 H1.8
GPA5: length 33.1
  Top Layer w0.254: v1(8.13,14.61) 8.13,8.6 U16.22
  Bottom Layer w0.254: v1(8.13,14.61) 8.13,34.04 6.41,35.75 5.9,35.75 4.82,36.83 H1.9
GPA6: length 35.9
  Top Layer w0.254: v1(0.61,21.59) 2.73,19.46 2.73,8.44 3.39,7.79 6.94,7.79 8.35,6.38 U16.23
  Bottom Layer w0.254: v1(0.61,21.59) 0.61,31.09 H1.10
GPA7: length 33.9
  Top Layer w0.254: v1(0.6,19.05) 0.64,19.05 2.38,17.31 2.38,8.3 3.24,7.43 6.8,7.43 8.51,5.72 9.7,5.72 U16.24
  Bottom Layer w0.254: v1(0.6,19.05) 1.19,19.64 1.19,29.13 H1.11
GPB0: length 32.8
  Top Layer w0.254: U16.25 3.55,5.08 2.73,5.9 2.73,7.44 2.02,8.15 2.02,15.09 v1(0.6,16.51)
  Bottom Layer w0.254: v1(0.6,16.51) 0.6,16.87 1.55,17.81 1.55,26.95 H1.12
GPB1: length 34
  Top Layer w0.254: 0.53,14.05 1.66,12.92 1.66,8 2.38,7.29 2.38,3.25 3.06,2.56 7.48,2.56 9.34,4.43 U16.26
  Bottom Layer w0.254: v1(0.6,13.97) 0.6,14.32 1.64,15.35 1.64,17.37 1.9,17.64 1.9,24.76 H1.13
GPB2: length 31.6
  Top Layer w0.254: 0.6,11.4 1.31,10.7 1.31,7.85 2.02,7.14 2.02,3.1 2.92,2.21 7.62,2.21 9.2,3.78 U16.27
  Bottom Layer w0.254: H1.14 2.26,22.58 2.26,17.49 1.99,17.23 1.99,15.21 1.64,14.85 1.64,12.82 0.6,11.79 v1(0.6,11.43)
GPB3: length 29.4
  Top Layer w0.254: 0.61,9.03 v1(0.61,8.89) 0.95,8.54 0.95,7.71 1.66,6.99 1.66,2.96 2.77,1.85 7.77,1.85 9.05,3.13 9.57,3.13
  Bottom Layer w0.254: v1(0.61,8.89) 0.61,9.25 1.64,10.28 1.64,12.29 1.99,12.65 1.99,14.69 2.35,15.04 2.35,17.08 2.61,17.34 2.61,20.39 H1.15
GPB4: length 28.5
  Top Layer w0.254: U16.1 10.16,1.5 2.62,1.5 1.06,3.05 0.61,3.05
  Bottom Layer w0.254: 0.61,3.05 0.77,3.05 1.31,3.59 1.31,8.66 1.66,9.01 1.66,9.78 2.02,10.14 2.02,12.17 2.38,12.53 2.38,14.56 2.73,14.92 2.73,16.96 3.81,18.04 H1.16
  vias: v1(0.61,2.92)
GPB5: length 27.6
  Top Layer w0.254: U16.2 11.4,1.84 10.7,1.14 2.47,1.14 1.39,2.22 0.61,2.22
  Bottom Layer w0.254: H1.17 3.81,15.5 2.73,14.42 2.73,12.38 2.38,12.02 2.38,9.99 2.02,9.63 2.02,8.86 1.66,8.51 1.66,2.92 0.96,2.22 0.61,2.22
  vias: v1(0.61,2.16)
GPB6: length 26.5
  Top Layer w0.254: U16.3 12.05,1.72 11.11,0.78 2.33,0.78 1.68,1.43 0.61,1.43
  Bottom Layer w0.254: 0.61,1.43 0.96,1.43 2.02,2.48 2.02,8.36 2.38,8.72 2.38,9.48 2.73,9.84 2.73,11.88 3.81,12.96 H1.18
  vias: v1(0.61,1.4)
GPB7: length 25.4
  Top Layer w0.254: U16.4 12.7,1.72 11.4,0.43 2.15,0.43 1.97,0.61 0.61,0.61
  Bottom Layer w0.254: 0.61,0.61 0.96,0.61 2.38,2.02 2.38,8.21 2.73,8.57 2.73,9.34 3.81,10.42 H1.19
  vias: v1(0.61,0.64)
GPC0: length 62.6
  Top Layer w0.254: U17.17 37.47,2.08 v1(37.47,1.24) ; v1(41.41,0.6) 41.64,0.83 48.66,0.83 49.49,1.67 49.49,47.03 H4.4
  Bottom Layer w0.254: v1(41.41,0.6) 41.23,0.43 38.28,0.43 v1(37.47,1.24)
GPC1: length 58.4
  Top Layer w0.254: U17.18 38.1,1.72 39.16,0.67 40.65,0.67 41.17,1.19 48.51,1.19 49.14,1.81 49.14,44.84 H4.5
GPC2: length 54.2
  Top Layer w0.254: U17.19 38.75,1.84 39.56,1.02 40.39,1.02 40.91,1.54 48.36,1.54 48.78,1.96 48.78,42.66 H4.6
GPC3: length 50.2
  Top Layer w0.254: U17.20 39.4,1.84 39.86,1.38 40.24,1.38 40.76,1.9 48.22,1.9 48.43,2.11 48.43,40.48 H4.7
GPC4: length 45.8
  Top Layer w0.254: H4.8 48.07,38.29 48.07,2.26 40.58,2.26 40.23,1.91 40.23,1.91 U17.21
GPC5: length 44.3
  Top Layer w0.254: U17.22 42.06,3.13 v1(42.19,3.25)
  Bottom Layer w0.254: H4.9 49.49,34.33 49.49,9.88 48.78,9.17 48.78,2.6 48.2,2.02 43.01,2.02 42.59,2.44 42.59,2.85 v1(42.19,3.25)
GPC6: length 41.4
  Top Layer w0.254: U17.23 41.89,3.78 41.94,3.84 42.63,3.84 42.66,3.81 v1(42.72,3.81)
  Bottom Layer w0.254: v1(42.72,3.81) 42.95,3.58 42.95,2.59 43.16,2.38 48.05,2.38 48.43,2.75 48.43,9.32 49.14,10.03 49.14,32.14 H4.10
GPC7: length 38.6
  Top Layer w0.254: U17.24 41.17,4.5 v1(43.11,4.5)
  Bottom Layer w0.254: H4.11 48.78,29.96 48.78,10.18 48.07,9.47 48.07,2.89 47.91,2.73 43.31,2.73 43.31,3.57 43.3,3.58 43.3,4.3 v1(43.11,4.5)
GPD0: length 30.1
  Top Layer w0.254: v1(40.64,17.35) 42.51,15.48 42.51,6.14 41.46,5.08 U17.25
  Bottom Layer w0.254: H4.12 46.61,28.83 46.61,27.88 46.16,27.88 45.91,27.63 45.91,25.08 45.56,24.72 45.56,23.71 44.52,22.67 44,22.67 43.31,21.97 43.31,19.94 43.02,19.64 43.02,17.61 42.88,17.48 40.77,17.48 v1(40.64,17.35)
GPD1: length 26.4
  Top Layer w0.254: v1(40.64,16.46) 42.16,14.94 42.16,6.43 41.46,5.73 U17.26
  Bottom Layer w0.254: H4.13 46.99,25.21 46.54,25.21 45.91,24.58 45.91,22.54 45.56,22.18 45.56,21.17 44.52,20.13 44,20.13 43.37,19.5 43.37,17.46 42.37,16.46 v1(40.64,16.46)
GPD2: length 22.7
  Top Layer w0.254: U17.27 41.46,6.38 41.8,6.72 41.8,14.41 v1(40.64,15.57)
  Bottom Layer w0.254: v1(40.64,15.57) 41.98,15.57 44,17.59 44.52,17.59 45.56,18.63 45.56,19.69 45.91,20.04 45.91,22.04 46.54,22.67 46.99,22.67 H4.14
GPD3: length 19.7
  Top Layer w0.254: v1(40.64,14.68) 41.44,13.88 41.44,7.38 U17.28
  Bottom Layer w0.254: H4.15 46.99,20.58 45.91,19.5 45.91,17.52 45.56,17.17 45.56,16.09 44.87,15.41 43.86,15.41 43.13,14.68 v1(40.64,14.68)
GPD4: length 17.8
  Top Layer w0.254: v1(38.54,13.16) 40.05,11.65 U17.1
  Bottom Layer w0.254: H4.16 46.99,18.1 45.91,17.02 45.91,15.94 45.02,15.05 44,15.05 42.2,13.25 39.16,13.25 39.07,13.16 v1(38.54,13.16)
GPD5: length 16.8
  Top Layer w0.254: U17.2 39.4,11.16 v1(38.03,12.52)
  Bottom Layer w0.254: H4.17 46.99,15.62 45.91,14.54 45.91,13.39 45.41,12.89 39.31,12.89 38.94,12.52 v1(38.03,12.52)
GPD6: length 13.8
  Top Layer w0.254: U17.3 38.75,10.92 v1(38.03,11.63)
  Bottom Layer w0.254: H4.18 45.56,12.54 39.46,12.54 38.56,11.63 v1(38.03,11.63)
GPD7: length 12.3
  Top Layer w0.254: v1(38.03,10.74) 38.1,10.74 U17.4
  Bottom Layer w0.254: H4.19 45.91,10.35 42.49,10.35 42.09,10.74 v1(38.03,10.74)
GPIO4: length 12.3
  Top Layer w0.254: H2.12 6.35,28.2 7.52,27.03 15.12,27.03 16.16,28.07 16.52,28.07 U1.4
GPIO5: length 10.4
  Top Layer w0.254: U1.5 16.39,26.67 H2.13
GPIO6: length 27.5
  Top Layer w0.254: U1.6 16.65,25.65 16.29,25.65 15.62,24.99 15.62,24.23 15.19,23.8 15.19,17.94 14.91,17.66 14.91,16.86 14.55,16.51 14.55,14.79 9.85,14.79 8.23,16.4 8.23,16.61 8.22,16.61 8.22,17.17 7.83,17.57 7.83,19.6 7.5,19.93 7.5,21.97 6.35,23.12 H2.14
GPIO7: length 24.6
  Top Layer w0.254: 16.65,24.39 16.65,24.38 16.64,24.38 16.1,23.85 15.78,23.85 15.55,23.61 15.55,17.8 15.27,17.52 15.27,16.72 14.91,16.36 14.91,14.43 9.7,14.43 7.87,16.26 7.87,16.26 7.87,17.02 7.47,17.42 7.47,19.46 6.35,20.58 H2.15
GPIO8: length 16.8
  Top Layer w0.254: H2.16 6.35,18.04 7.51,16.87 7.51,16.05 9.48,14.08 15.27,14.08 15.27,16.21 15.62,16.57 15.62,17.37 15.91,17.65 16.26,17.65 U1.12
GPIO9: length 27.3
  Top Layer w0.254: v1(20.96,15.49) U1.17
  Bottom Layer w0.254: v1(20.96,15.49) 20.96,9.9 19.55,8.5 11.13,8.5 8.14,11.49 8.14,13.71 6.35,15.5 H2.17
GPIO10: length 26
  Top Layer w0.254: v1(22.22,15.48) U1.18
  Bottom Layer w0.254: 17.73,8.14 10.98,8.14 7.78,11.34 7.78,12.54 H2.18 ; 17.83,8.14 19.69,8.14 21.31,9.76 21.31,11.72 22.19,12.59 22.19,15.48
GPIO11: length 25.5
  Top Layer w0.254: v1(23.5,15.49) U1.19
  Bottom Layer w0.254: v1(23.5,15.49) 23.5,13.4 21.67,11.57 21.67,9.61 19.84,7.79 10.84,7.79 7.19,11.43 H2.19
GPIO12: length 28.4
  Top Layer w0.254: v1(30.46,19.3) 29.49,19.3 24.77,14.58 U1.20
  Bottom Layer w0.254: v1(30.46,19.3) 38.42,19.3 43.02,23.9 43.02,24.73 43.37,25.08 43.37,27.12 44,27.75 44.45,28.19 H3.12
GPIO13: length 25
  Top Layer w0.254: U1.21 26.03,14.74 29.84,18.54 v1(30.46,18.54)
  Bottom Layer w0.254: v1(30.46,18.54) 38.16,18.54 43.37,23.75 43.37,24.58 44.45,25.66 H3.13
GPIO14: length 21.7
  Top Layer w0.254: v1(30.46,17.78) 30.16,17.78 27.31,14.92 U1.22
  Bottom Layer w0.254: v1(30.46,17.78) 37.9,17.78 44.25,24.13 H3.14
GPIO15: length 35.2
  Top Layer w0.254: v1(17.91,23.11) 16.65,23.11 U1.8 ; H3.15 v1(42.72,21.59)
  Bottom Layer w0.254: v1(17.91,23.11) 19.89,23.11 28.93,14.07 35.91,14.07 38.62,16.77 38.62,17.66 42.55,21.59 v1(42.72,21.59)
GPIO16: length 33.9
  Top Layer w0.254: v1(17.91,21.84) 16.65,21.84 U1.9 ; v1(42.42,19.05) H3.16
  Bottom Layer w0.254: v1(17.91,21.84) 20.53,21.84 28.66,13.72 36.06,13.72 38.97,16.63 38.97,17.52 40.51,19.05 v1(42.42,19.05)
GPIO17: length 34.4
  Top Layer w0.254: U1.10 17.91,20.58 v1(17.91,20.57) ; v1(42.43,18.06) 43.98,16.51 H3.17
  Bottom Layer w0.254: v1(17.91,20.57) 21.3,20.57 28.51,13.36 36.21,13.36 39.33,16.48 39.33,17.37 40.66,18.69 41.8,18.69 v1(42.43,18.06)
GPIO18: length 35.3
  Top Layer w0.254: U1.11 17.91,19.31 v1(17.91,19.3) ; v1(41.29,18.06) 41.31,18.06 44.45,14.92 H3.18
  Bottom Layer w0.254: v1(41.29,18.06) 40.53,18.06 39.69,17.22 39.69,16.33 36.36,13 28.36,13 22.06,19.3 v1(17.91,19.3)
GPIO21: length 22.7
  Top Layer w0.254: v1(28.58,15.37) U1.23 ; v1(38.03,17.09) 39.25,15.88 39.25,13.3 40.86,11.69 v1(40.86,11.33)
  Bottom Layer w0.254: v1(38.03,17.09) 35.37,14.43 29.46,14.43 28.58,15.31 v1(28.58,15.37) ; H3.19 44.35,11.33 v1(40.86,11.33)
LRBJ: length 44.1
  Bottom Layer w0.254: H2.21 6.35,6.73 6.69,7.07 19.5,7.07 19.73,6.84 19.73,6.56 20.91,5.38 30.21,5.38 35.37,10.54 36.35,10.54 37.08,9.8 41.89,9.8 44.72,6.98 44.72,6.62 H3.21
LRTJ: length 54.1
  Bottom Layer w0.254: H3.2 44.45,54.1 43.02,52.66 43.02,45.39 9.05,45.39 8.84,45.6 8.84,47.23 7.43,48.64 7.43,52.52 6.35,53.6 H2.2
MTCK: length 56.2
  Top Layer w0.254: U1.32 34.47,21.85 36.96,24.33 36.96,37.22 37.24,37.49 37.24,39.85 35.43,41.66 11.17,41.66 7.43,45.4 7.43,48.45 H2.4
MTDI: length 48.6
  Top Layer w0.254: 34.15,24.39 34.51,24.39 36.25,26.13 36.25,37.51 36.53,37.79 36.53,39.54 35.12,40.95 10.88,40.95 7.37,44.45 H2.6
MTDO: length 52.1
  Top Layer w0.254: H2.5 6.35,45.98 11.02,41.3 35.28,41.3 36.88,39.7 36.88,37.64 36.6,37.36 36.6,25.21 34.51,23.12 U1.33
MTMS: length 46.1
  Top Layer w0.254: U1.35 34.51,25.66 35.89,27.04 35.89,37.66 36.17,37.94 36.17,39.39 34.97,40.59 6.91,40.59 6.35,41.15 H2.7
PWRLED: length 4.3
  Top Layer w0.254: LED1
PWR.1 9.01,66.13 9.01,62.36
RX: length 43.4
  Top Layer w0.254: U1.36 34.51,26.93 35.53,27.95 35.53,37.81 35.81,38.08 35.81,39.24 34.82,40.23 7.21,40.23 H2.8
SCK: length 123.3
  Top Layer w0.254: 21.97,74.3 19.72,74.3 19.03,73.6 19,73.6 19,72.61 19.16,72.45 34.48,72.45 39.25,67.68 39.25,65.71 39.1,65.71 39.1,65.66 38.17,65.66 ; U16.8 19.13,3.13 20.72,1.54 30.24,1.54 30.5,1.8 30.5,5.62 31.33,6.45 33.46,6.45 34.04,7.03 ; v1(35.94,9.08) 35.94,11.54 v1(35.92,11.56) ; 34.04,7.03 v1(34.04,7.11) ; 34.04,7.03 U17.8 ; 38.03,65.66 38.17,65.66 ; v1(36.58,20.7) 36.45,20.58 U1.31 ; v1(39.84,13.83) 39.84,16.12 37.85,18.11 v1(37.85,20.7) 37.67,20.88 37.67,36.92 38.7,37.95 38.7,57.55 38.53,57.72 v1(38.53,58.12)
  Bottom Layer w0.254: v1(34.04,7.11) 34.04,8.19 35.52,9.68 35.88,9.68 35.94,9.62 v1(35.94,9.08) ; v1(36.58,20.7) v1(37.85,20.7) ; v1(38.53,58.12) 38.46,58.12 37.94,58.64 37.94,65.57 v1(38.02,65.66) ; v1(39.84,13.83) 39.78,13.78 38.14,13.78 38.14,13.78 v1(35.92,11.56)
SCL: length 90.4
  Top Layer w0.254: v1(47.45,76.49) 47.45,77.79 ; 47.45,77.79 46.47,77.79 U4.4 ; 47.45,77.79 U5.3 ; U3.1 44.46,73.77 44.71,73.53 46.57,73.53 48.04,74.99 v1(48.04,75.3) ; v1(39.7,60.2) 38.89,60.2 24.13,45.44 U6.3 ; R8.1 33.92,13.97 33.12,14.77 33.12,15.11 32.15,16.08 30.66,16.08 29.95,15.37 v1(29.84,15.37) U1.24
  Bottom Layer w0.254: v1(29.84,15.37) 29.52,15.7 29.52,35.76 24.13,41.14 U6.3 ; v1(39.7,60.2) 48.04,68.53 v1(48.04,75.3) 48.04,75.9 v1(47.45,76.49)
SDA: length 120
  Top Layer w0.254: U5.2 47.91,79.37 49.09,78.2 49.09,77.29 48.04,76.24 ; 47.45,75.66 45.81,77.3 45.81,77.96 46.27,78.42 U4.3 ; 47.45,75.66 48.04,76.24 ; 47.45,75.66 47.45,75.14 46.37,74.06 U3.4 ; 48.04,76.24 48.62,75.66 48.62,75.04 47.24,73.66 v1(47.24,73.28) ; R9.1 9.01,44.32 11.32,42.01 20.42,42.01 U6.4 21.59,43.4 39.27,61.09 v1(39.7,61.09) ; v1(31.12,15.37) U1.25
  Bottom Layer w0.254: v1(47.24,73.28) 47.24,68.63 v1(39.7,61.09) ; U6.4 29.16,35.61 29.16,15.23 29.6,14.78 30.43,14.78 31.01,15.37 v1(31.12,15.37)
SDI: length 107.9
  Top Layer w0.254: U18.5 U18.5 31.84,73.03 32.06,72.8 34.63,72.8 39.6,67.82 39.6,65.56 39.12,65.08 v1(38.52,65.08) ; v1(35.31,8.64) 35.31,11.33 U1.26 32.39,15.34 32.23,15.49 v1(31.88,15.49) ; 34.2,6.1 31.48,6.1 30.86,5.47 30.86,1.65 30.39,1.18 20.58,1.18 19.21,2.55 v1(16.64,2.55) ; v1(37.21,17.15) 37.21,21.18 37.31,21.29 37.31,37.07 38.34,38.1 38.34,57.4 37.95,57.8 37.95,58.36 38.34,58.76 38.4,58.76 v1(38.52,58.88) ; v1(34.29,6.31) 35.04,6.31 U17.9 ; v1(16.64,3.71) 16.57,3.78 U16.9
  Bottom Layer w0.254: v1(35.31,8.64) 34.62,7.95 34.62,6.64 v1(34.29,6.31) ; v1(31.88,15.49) 35.56,15.49 v1(37.21,17.15) ; v1(16.64,2.55) v1(16.64,3.71) ; v1(38.52,58.88) v1(38.52,65.08)
SDO: length 126.1
  Top Layer w0.254: 28.83,74.3 31.08,74.3 32.21,73.16 34.77,73.16 39.96,67.97 39.96,62.28 22.03,44.35 21.73,44.35 arc(21.59,44.36) 21.45,44.35 21.09,44.35 20.41,43.67 20.41,42.73 20.36,42.67 v1(15.37,42.67) ; v1(17.35,9.08) 17.94,9.67 19.55,9.67 20.3,8.92 20.3,6.82 18.61,5.13 18.1,5.13 17.4,4.43 ; v1(17.4,1.96) 19.29,1.96 20.43,0.83 30.54,0.83 31.21,1.5 31.21,5.32 31.62,5.73 U17.10 ; 17.4,4.43 v1(17.4,3.71) ; 17.4,4.43 U16.10 ; v1(20.07,15.49) 20.07,14.22 U1.16 19.69,12.93 v1(18.26,11.51)
  Bottom Layer w0.254: v1(17.4,3.71) v1(17.4,1.96) ; v1(17.35,9.08) 17.35,10.53 18.08,11.26 18.08,11.33 v1(18.26,11.51) ; v1(15.37,42.67) 15.27,42.57 15.27,20.62 17.52,18.36 18.02,18.36 20.07,16.32 v1(20.07,15.49)
ST_CS: length 81.7
  Top Layer w0.254: v1(38.61,20.7) 38.61,20.77 38.03,21.35 38.03,36.77 39.11,37.86 39.11,57.94 v1(39.29,58.12) ; v1(36.58,19.89) 36.49,19.89 35.18,18.58 34.15,18.58 U1.29 ; U18.2 U18.2 18.64,74.48 18.64,72.46 19.01,72.09 34.33,72.09 38.41,68.01 38.41,66.24
  Bottom Layer w0.254: 38.41,66.24 39.11,65.54 39.11,58.29 v1(39.29,58.12) ; v1(36.58,19.89) 36.81,20.12 38.09,20.12 38.61,20.64 38.61,20.65
  vias: v1(38.52,66.24)
TBLJ: length 44.4
  Top Layer w0.254: H2.3 6.35,51.06 4.89,49.6 4.89,10.35 H2.20
TBRJ: length 44.4
  Top Layer w0.254: H3.3 45.91,50.61 45.91,10.35 H3.20
TX: length 42.9
  Top Layer w0.254: U1.37 34.47,28.2 35.18,28.9 35.18,37.95 35.46,38.23 35.46,39.1 34.68,39.88 8.38,39.88 6.35,37.84 H2.9
X_CS: length 40.9
  Top Layer w0.254: U16.7 16.05,2.08 16.76,1.38 19.37,1.38 20.28,0.47 30.68,0.47 31.57,1.35 31.57,1.74 31.8,1.97 v1(31.8,2.03) ; U1.28 35.9,16.77 36.63,16.04 36.63,9.43 v1(36.65,9.42) 36.65,8.82 36.34,8.51 36.34,8.27 U17.7
  Bottom Layer w0.254: v1(31.8,2.03) 31.86,2.03 32.38,2.55 32.38,7.04 35.52,10.18 35.88,10.18 v1(36.65,9.42)
XA0: length 56
  Top Layer w0.254: v1(19.3,15.49) 19.24,15.49 18.72,16.01 18.72,16.5 19.07,16.85 26.03,16.85 32.77,23.59 32.77,29.71 33.79,30.74 U1.39 ; v1(31.8,5.08) U17.11 ; U16.11 15.8,5.19 17.5,5.19 17.81,5.49 18.31,5.49 19.15,6.32 v1(19.15,6.49) 19.31,6.65 v1(19.31,9.09)
  Bottom Layer w0.254: v1(19.15,6.49) 19.3,6.49 20.77,5.02 31.73,5.02 v1(31.8,5.08) ; v1(19.31,9.09) 19.31,15.49 v1(19.3,15.49)
XA1: length 54.8
  Top Layer w0.254: v1(18.55,9.09) 18.55,6.65 v1(18.38,6.49) 18.38,6.13 18.1,5.84 17.65,5.84 17.35,5.54 16.39,5.54 16.02,5.92 15.89,5.92 U16.12 ; 32.05,4.32 34.35,4.32 34.47,4.43 U17.12 ; v1(19.3,16.26) 25.94,16.26 33.12,23.44 33.12,28.93 33.66,29.46 34.15,29.46 34.15,29.47
  Bottom Layer w0.254: v1(19.3,16.26) 19.13,16.08 19.06,16.08 18.72,15.74 18.72,12.09 18.84,11.97 18.84,11.22 18.55,10.92 v1(18.55,9.09) ; v1(31.8,4.32) 31.09,4.32 30.75,4.66 20.6,4.66 19.36,5.91 18.9,5.91 18.38,6.43 v1(18.38,6.49)
XA2: length 30.4
  Top Layer w0.254: U16.13 16.06,6.38 16.54,5.9 17.09,5.9 17.69,6.49 16.59,7.59 v1(16.59,9.08) ; v1(17.5,11.51) 17.5,11.57 18.41,12.49 U1.15 ; v1(31.8,3.56) 31.8,3.73 32.38,3.73 32.38,3.78 U17.13
  Bottom Layer w0.254: v1(31.8,3.56) 31.35,3.56 30.6,4.31 20.46,4.31 19.22,5.55 18.38,5.55 17.62,6.31 v1(17.62,6.49) ; v1(16.59,9.08) 16.59,10.6 v1(17.5,11.51)
XRES: length 21.4
  Top Layer w0.254: U17.14 32.38,3.13 32.04,2.79 v1(31.8,2.79) ; v1(16.86,6.49) 16.48,6.49 16.13,6.84 16.03,6.84 15.84,7.03 U16.14
  Bottom Layer w0.254: v1(31.8,2.79) 31.48,2.79 30.32,3.95 20.18,3.95 18.94,5.19 18.05,5.19 16.86,6.38 v1(16.86,6.49)

## Text on the board
Bottom Silkscreen Layer: YTK-DE1/1
Top Silkscreen Layer: JLCJLCJLCJLC | YTK-DE1/1
